# EAGLE schematic io3 (EAGLE 7.2.0)
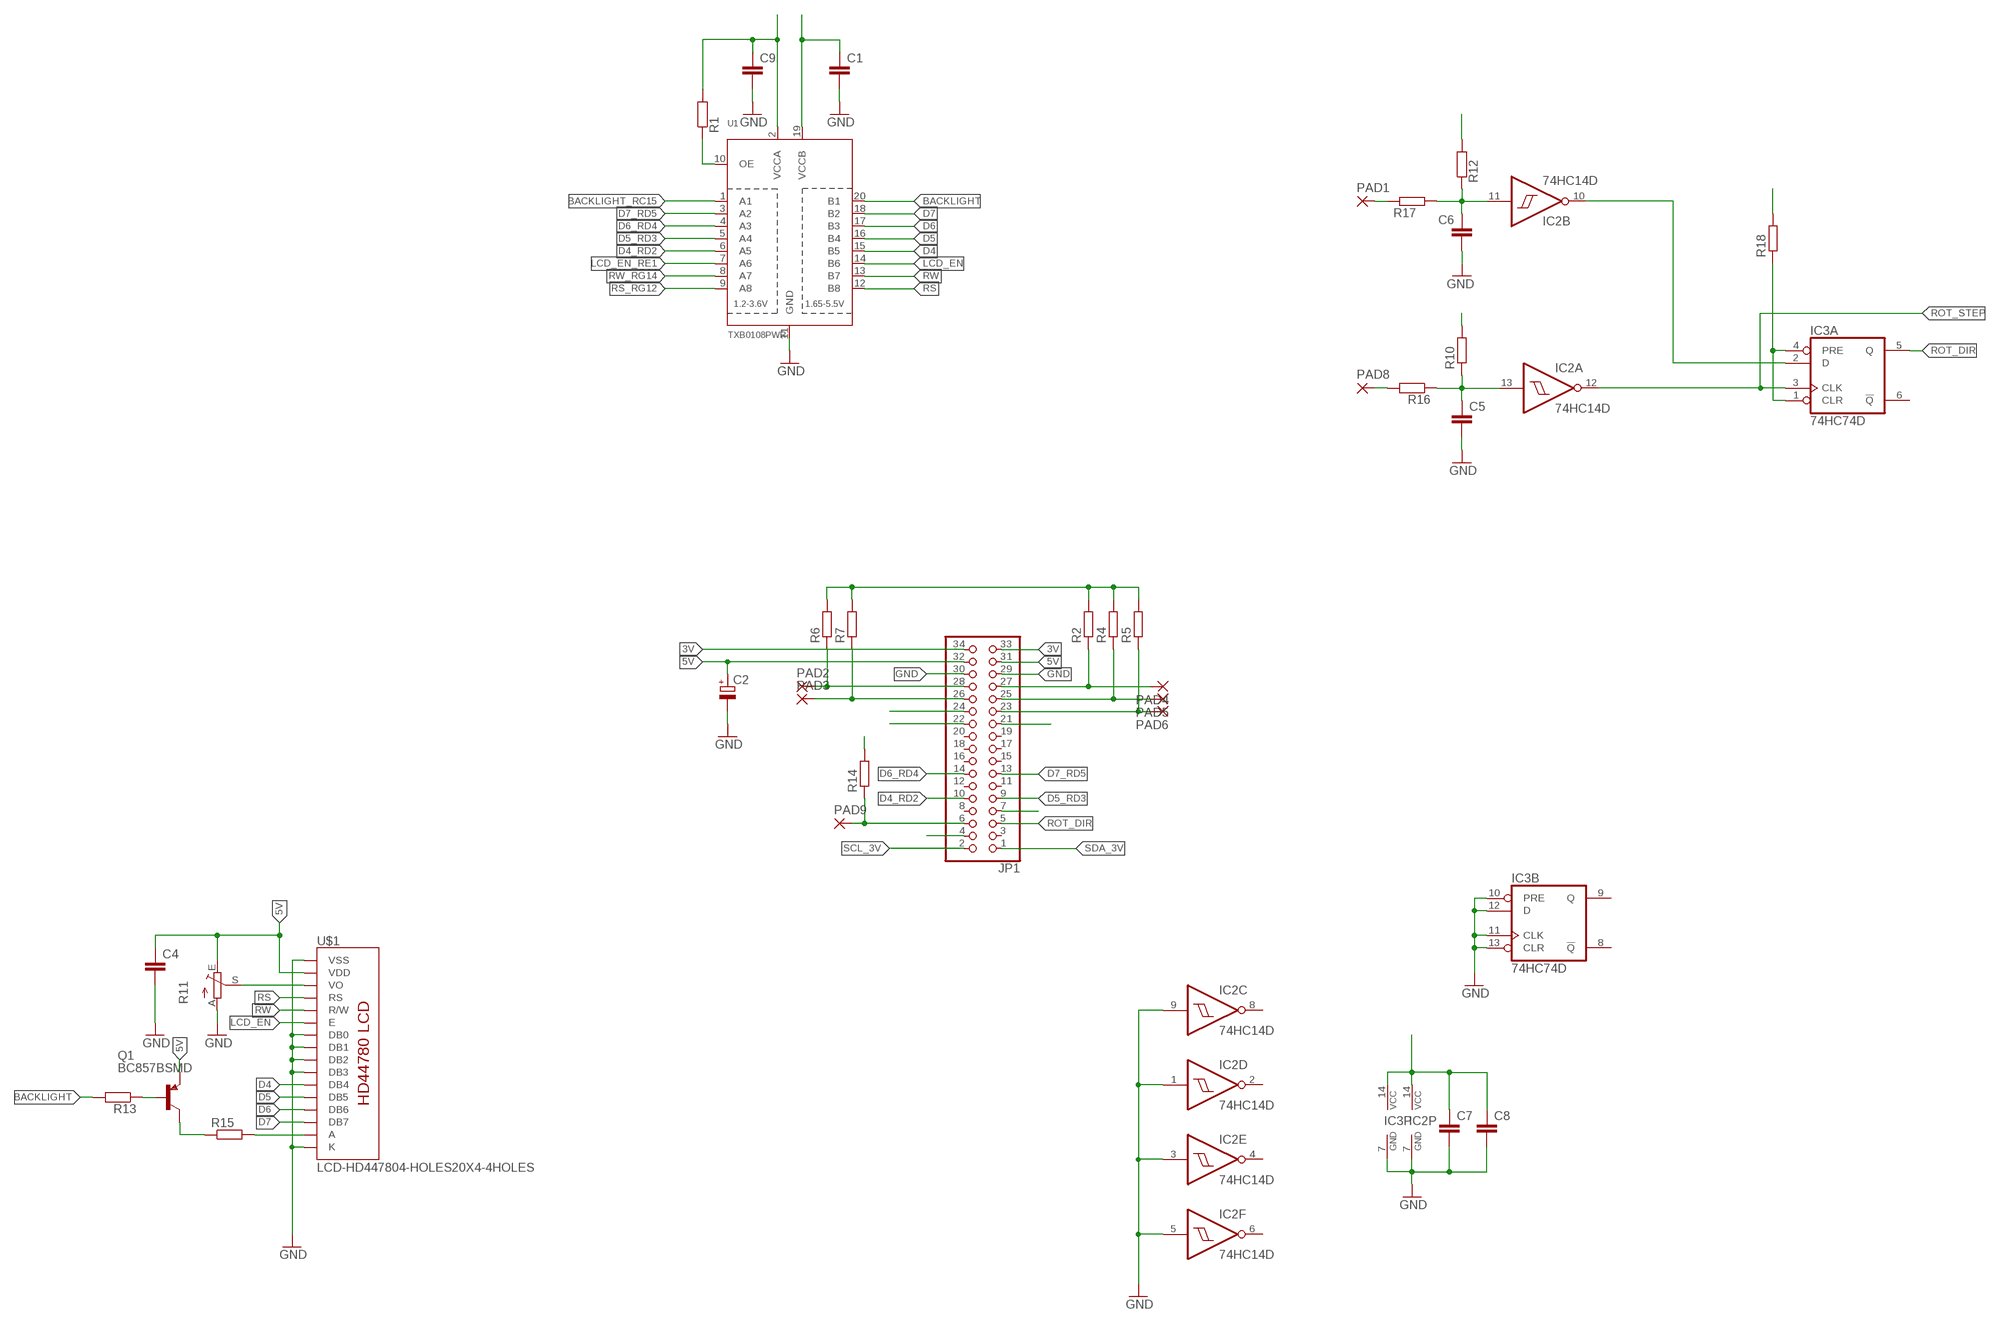
[diagram p0: schematic, sheet 1]

## Parts
C1  C-EUC0603  [C0603]
C2  CPOL-EUSMCD  [SMC_D]
C4  C-EUC1206  [C1206]
C5  C-EUC0603  [C0603]
C6  C-EUC0603  [C0603]
C7  C-EUC0603  [C0603]
C8  C-EUC0603  [C0603]
C9  C-EUC0603  [C0603]
IC2  74HC14D  [SO14]
IC3  74HC74D  [SO14]
JP1  PINHD-2X17_2.54-SMD  [2X17SMD]
PAD1  SMD2  [SMD1,27-2,54]
PAD2  SMD2  [SMD1,27-2,54]
PAD3  SMD2  [SMD1,27-2,54]
PAD4  SMD2  [SMD1,27-2,54]
PAD5  SMD2  [SMD1,27-2,54]
PAD6  SMD2  [SMD1,27-2,54]
PAD8  SMD2  [SMD1,27-2,54]
PAD9  SMD2  [SMD1,27-2,54]
Q1  BC857BSMD  [SOT23-BEC]
R1  R-EU_R0603  [R0603]
R2  R-EU_0204/7  [0204/7]
R4  R-EU_0204/7  [0204/7]
R5  R-EU_0204/7  [0204/7]
R6  R-EU_0204/7  [0204/7]
R7  R-EU_0204/7  [0204/7]
R10  R-EU_0204/7  [0204/7]
R11  TRIM_EU-B25U  [B25U]
R12  R-EU_0204/7  [0204/7]
R13  R-EU_R0603  [R0603]
R14  R-EU_0204/5  [0204/5]
R15  R-EU_R1206  [R1206]
R16  R-EU_R0603  [R0603]
R17  R-EU_R0603  [R0603]
R18  R-EU_0204/7  [0204/7]
U1  TXB0108PWR  [TSSOP20]
U$1  LCD-HD447804-HOLES20X4-4HOLES  [LCD-20X4-4HOLES]

## Nets
3V: C7.1 C8.1 C9.1 IC2.14(P:VCC) IC3.14(P:VCC) JP1.33 JP1.34 R1.2 R2.2 R4.2 R5.2 R6.2 R7.2 R10.2 R12.2 R14.2 R18.2 U1.2(VCCA)
5V: C1.1 C2.+ C4.1 JP1.31 JP1.32 Q1.E R11.E U1.19(VCCB) U$1.P$2(VDD)
BACKLIGHT: R13.2 U1.20(B1)
BACKLIGHT_RC15: JP1.4 U1.1(A1)
D4: U1.15(B5) U$1.P$11(DB4)
D4_RD2: JP1.10 U1.6(A5)
D5: U1.16(B4) U$1.P$12(DB5)
D5_RD3: JP1.9 U1.5(A4)
D6: U1.17(B3) U$1.P$13(DB6)
D6_RD4: JP1.14 U1.4(A3)
D7: U1.18(B2) U$1.P$14(DB7)
D7_RD5: JP1.13 U1.3(A2)
GND: C1.2 C2.- C4.2 C5.2 C6.2 C7.2 C8.2 C9.2 IC2.1(D:I) IC2.3(E:I) IC2.5(F:I) IC2.7(P:GND) IC2.9(C:I) IC3.7(P:GND) IC3.10(B:PRE) IC3.11(B:CLK) IC3.12(B:D) IC3.13(B:CLR) JP1.29 JP1.30 R11.A U1.11(GND) U$1.P$1(VSS) U$1.P$7(DB0) U$1.P$8(DB1) U$1.P$9(DB2) U$1.P$10(DB3) U$1.P$16(K)
LCD_EN: U1.14(B6) U$1.P$6(E)
LCD_EN_RE1: JP1.22 U1.7(A6)
N$1: Q1.C R15.1
N$2: IC3.1(A:CLR) IC3.4(A:PRE) R18.1
N$3: R15.2 U$1.P$15(A)
N$4: R1.1 U1.10(OE)
N$5: PAD8.1(P) R16.2
N$6: Q1.B R13.1
N$7: PAD1.1(P) R17.1
N$14: R11.S U$1.P$3(VO)
ROT_A_DT: C5.1 IC2.13(A:I) R10.1 R16.1
ROT_B_: IC2.10(B:O) IC3.2(A:D)
ROT_B_CLK: C6.1 IC2.11(B:I) R12.1 R17.2
ROT_DIR: IC3.5(A:Q) JP1.5
ROT_STEP: IC2.12(A:O) IC3.3(A:CLK) JP1.7
ROT_SW: JP1.6 PAD9.1(P) R14.1
RS: U1.12(B8) U$1.P$4(RS)
RS_RG12: JP1.24 U1.9(A8)
RW: U1.13(B7) U$1.P$5(R/W)
RW_RG14: JP1.21 U1.8(A7)
S1: JP1.27 PAD4.1(P) R2.1
S2: JP1.28 PAD2.1(P) R6.1
S3: JP1.25 PAD5.1(P) R4.1
S4: JP1.26 PAD3.1(P) R7.1
S5: JP1.23 PAD6.1(P) R5.1
SCL_3V: JP1.2
SDA_3V: JP1.1
Unconnected: IC2.2(D:O) IC2.4(E:O) IC2.6(F:O) IC2.8(C:O) IC3.6(A:!Q) IC3.8(B:!Q) IC3.9(B:Q) JP1.3 JP1.8 JP1.11 JP1.12 JP1.15 JP1.16 JP1.17 JP1.18 JP1.19 JP1.20

## Library data of the parts
C1 C4-C9 = rcl:C-EU: CAPACITOR, European symbol
C2 = rcl:CPOL-EU: POLARIZED CAPACITOR, European symbol
IC2 = 74xx-eu:74*14: Hex schmitt trigger INVERTER
IC3 = 74xx-eu:74*74: Dual D type positive edge triggered FLIP FLOP, preset and clear
JP1 = pinhead-2:PINHD-2X17: PIN HEADER
PAD1-PAD6 PAD8 PAD9 = wirepad:SMD2: SMD PAD
Q1 = transistor-pnp:BC857*: PNP Transistror
R1 R2 R4-R7 R10 R12-R18 = rcl:R-EU_: RESISTOR, European symbol
R11 = pot:TRIM_EU-: POTENTIOMETER
U1 = microbuilder:TXB0108PWR: 8-Bit Bi-Directional Level Shifter 1.2V-3.6V (VCCA) to 1.65V-5.5V (VCCB) bi-directional level shifter with auto direction sensing. Max data rate - VCCA 1.8V: 20Mbps (50ns), VCCA 3.3V: 100Mbps (10ns) Digikey: 296-21527-1-ND
U$1 = HD44780LCD:LCD-HD44780